# Altium schematic sheet Sheet1.SchDoc
size A4; SheetNumber: 1; SheetTotal: 1
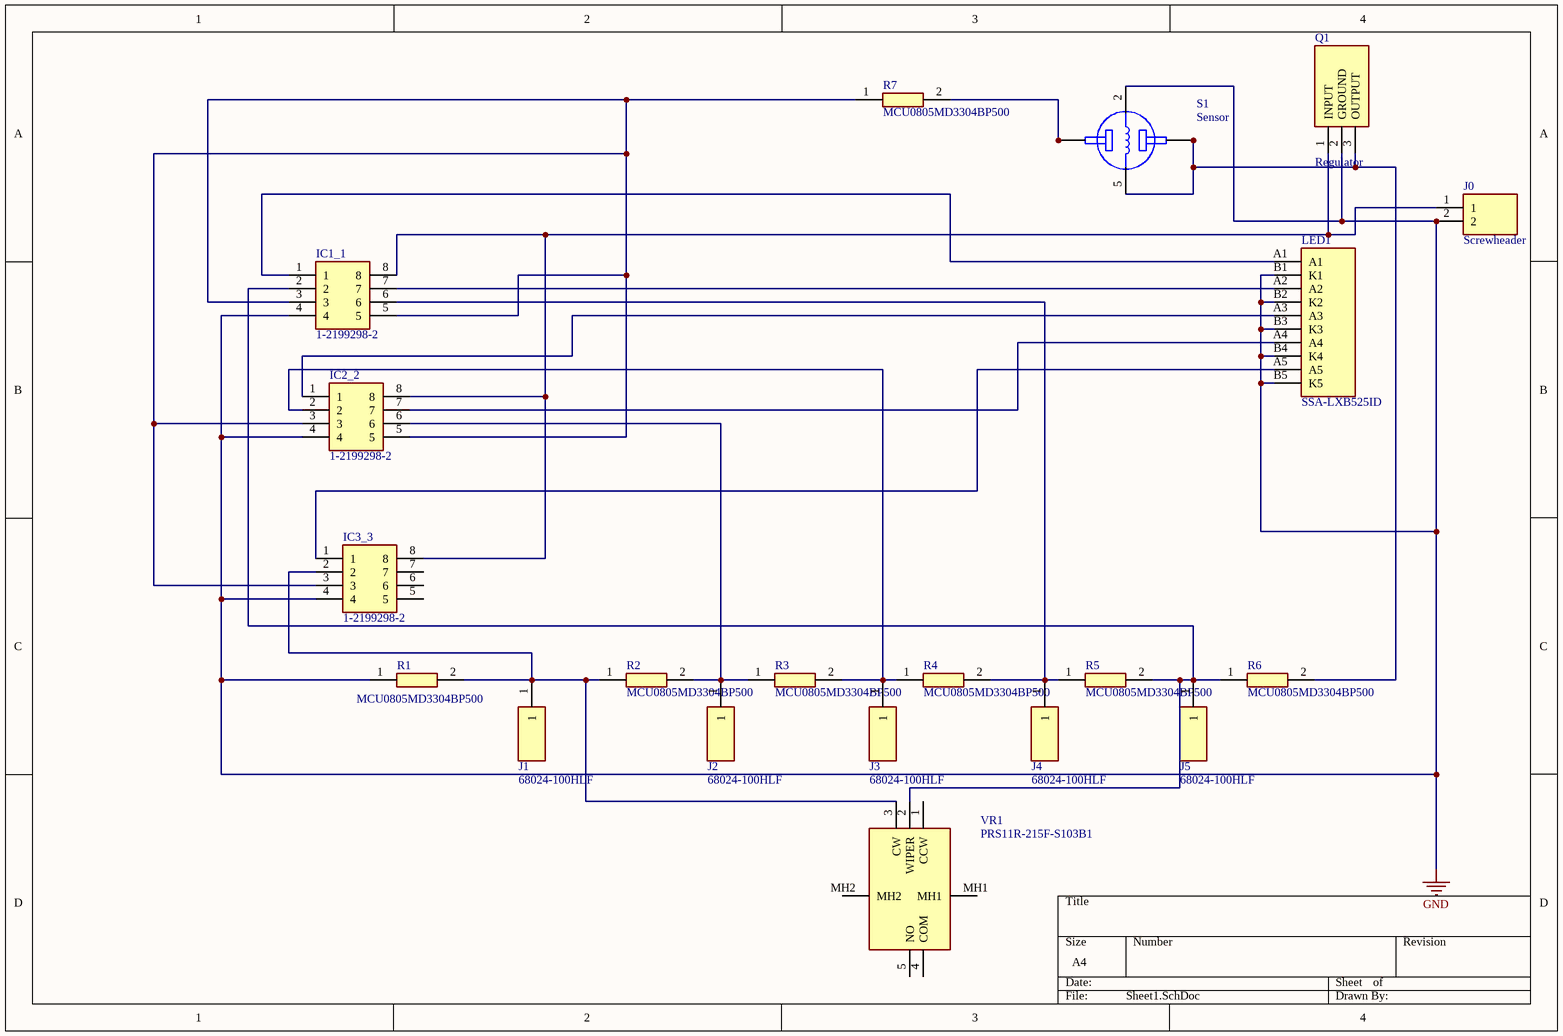
[diagram p0: Sheet1.SchDoc]

## Parts
IC1_1  1-2199298-2  [DIPS762W70P254L1016H510Q8N]
IC2_2  1-2199298-2  [DIPS762W70P254L1016H510Q8N]
IC3_3  1-2199298-2  [DIPS762W70P254L1016H510Q8N]
J0  Screwheader  [SHDR2W100P0X500_1X2_1120X800X1100P]
J1  68024-100HLF  [HDRV1W67P0X254_1X1_254X241X1082P]
J2  68024-100HLF  [HDRV1W67P0X254_1X1_254X241X1082P]
J3  68024-100HLF  [HDRV1W67P0X254_1X1_254X241X1082P]
J4  68024-100HLF  [HDRV1W67P0X254_1X1_254X241X1082P]
J5  68024-100HLF  [HDRV1W67P0X254_1X1_254X241X1082P]
LED1  SSA-LXB525ID  [SSALXB525ID]
Q1  Regulator  [TO255P460X1020X1968-3P]
R1  MCU0805MD3304BP500  [RESC2012X62N]
R2  MCU0805MD3304BP500  [RESC2012X62N]
R3  MCU0805MD3304BP500  [RESC2012X62N]
R4  MCU0805MD3304BP500  [RESC2012X62N]
R5  MCU0805MD3304BP500  [RESC2012X62N]
R6  MCU0805MD3304BP500  [RESC2012X62N]
R7  MCU0805MD3304BP500  [RESC2012X62N]
S1  Sensor  [XDCR_SEN-08880]
VR1  PRS11R-215F-S103B1  [PRS11R215FS103B1]

## Nets
GND: IC1_1.4 IC2_2.4 IC3_3.4 J0.2 LED1.B1(K1) LED1.B2(K2) LED1.B3(K3) LED1.B4(K4) LED1.B5(K5) Q1.2(GROUND) R1.1 S1.2(H1)
NetIC1_1_1: IC1_1.1 LED1.A1
NetIC1_1_2: IC1_1.2 J5.1 R5.2 R6.1 VR1.2(WIPER)
NetIC1_1_3: IC1_1.3 IC1_1.5 IC2_2.3 IC2_2.5 IC3_3.3 R7.1
NetIC1_1_6: IC1_1.6 J4.1 R4.2 R5.1
NetIC1_1_7: IC1_1.7 LED1.A2
NetIC1_1_8: IC1_1.8 IC2_2.8 IC3_3.8 J0.1 Q1.1(INPUT)
NetIC2_2_1: IC2_2.1 LED1.A3
NetIC2_2_2: IC2_2.2 J3.1 R3.2 R4.1
NetIC2_2_6: IC2_2.6 J2.1 R2.2 R3.1
NetIC2_2_7: IC2_2.7 LED1.A4
NetIC3_3_1: IC3_3.1 LED1.A5
NetIC3_3_2: IC3_3.2 J1.1 R1.2 R2.1 VR1.3(CW)
NetQ1_3: Q1.3(OUTPUT) R6.2 S1.4(B) S1.5(H2) S1.6(B)
NetR7_2: R7.2 S1.1(A) S1.3(A)

Not connected (* = marked no-connect by the designer): IC3_3 5 6 7; VR1 1(CCW) 4(COM) 5(NO) MH1 MH2

## Library data of the parts
IC1_1 IC2_2 IC3_3 = 1-2199298-2: Integrated Circuit; Manufacturer_Name: TE Connectivity; Datasheet Link: https://componentsearchengine.com/Datasheets/2/1-2199298-2.pdf; Height: 5.1mm; Manufacturer_Part_Number: 1-2199298-2; Mouser Part Number: 571-1-2199298-2; Mouser Price/Stock: https://www.mouser.co.uk/ProductDetail/TE-Connectivity/1-2199298-2?qs=fK8dlpkaUMtEKa4wabwOXQ%3D%3D; Arrow Part Number: 1-2199298-2; Arrow Price/Stock: https://www.arrow.com/en/products/1-2199298-2/te-connectivity?region=nac
J0 = 691111710002: Connector; Manufacturer_Name: Wurth Elektronik; Datasheet Link: https://componentsearchengine.com/Datasheets/1/691111710002.pdf; Height: 11mm; Manufacturer_Part_Number: 691111710002; Mouser Part Number: 710-691111710002; Mouser Price/Stock: https://www.mouser.co.uk/ProductDetail/Wurth-Elektronik/691111710002?qs=E2PpAYvlWVvK4tIr6ZnZIQ%3D%3D
J1-J5 = 68024-100HLF: Connector; Manufacturer_Name: Amphenol Communications Solutions; Datasheet Link: https://cdn.amphenol-cs.com/media/wysiwyg/files/drawing/68000.pdf; Height: 10.82mm; Manufacturer_Part_Number: 68024-100HLF; Mouser Part Number: 649-68024-100HLF; Mouser Price/Stock: https://www.mouser.co.uk/ProductDetail/Amphenol-FCI/68024-100HLF?qs=DaoqcPPPDvU%252BhB9srASBgQ%3D%3D; Arrow Part Number: 68024-100HLF; Arrow Price/Stock: https://www.arrow.com/en/products/68024-100hlf/amphenol-fci?region=nac
LED1 = SSA-LXB525ID: LED (Multiple); Manufacturer_Name: Lumex; Datasheet Link: https://datasheet.datasheetarchive.com/originals/dk/DKDS-14/273372.pdf; Height: 8.4mm; Manufacturer_Part_Number: SSA-LXB525ID; Mouser Part Number: 696-SSA-LXB525ID; Mouser Price/Stock: https://www.mouser.co.uk/ProductDetail/Lumex/SSA-LXB525ID?qs=K%252Bxkc0srH7Bjt6LUAQzTgQ%3D%3D; Arrow Part Number: SSA-LXB525ID; Arrow Price/Stock: https://www.arrow.com/en/products/ssa-lxb525id/lumex
Q1 = L7805ACV-DG: Transistor; Manufacturer_Name: STMicroelectronics; Datasheet Link: https://rs.componentsearchengine.com/Datasheets/2/L7805ACV-DG.pdf; Height: 4.6mm; Manufacturer_Part_Number: L7805ACV-DG; Mouser Part Number: 511-L7805ACV-DG; Mouser Price/Stock: https://www.mouser.co.uk/ProductDetail/STMicroelectronics/L7805ACV-DG?qs=UOUhb9503hEO7qX1qhGGyg%3D%3D; Arrow Part Number: L7805ACV-DG; Arrow Price/Stock: https://www.arrow.com/en/products/l7805acv-dg/stmicroelectronics?region=europe
R1-R7 = MCU0805MD3304BP500: Resistor; Manufacturer_Name: Vishay; Datasheet Link: https://www.mouser.in/datasheet/2/427/mc_at_precision-1762846.pdf; Height: 0.62mm; Manufacturer_Part_Number: MCU0805MD3304BP500; Mouser Part Number: 594-MCU0805MD3304BP5; Mouser Price/Stock: https://www.mouser.co.uk/ProductDetail/Vishay-Beyschlag/MCU0805MD3304BP500?qs=A6eO%252BMLsxmSZlVWVx087zg%3D%3D
VR1 = PRS11R-215F-S103B1: Variable Resistor; Manufacturer_Name: Bourns; Datasheet Link: https://www.mouser.com/catalog/specsheets/Bourns_03252021_PRS11R_datasheet.pdf; Height: 13.1mm; Manufacturer_Part_Number: PRS11R-215F-S103B1; Mouser Part Number: 652-PRS11R215FS103B1; Mouser Price/Stock: https://www.mouser.co.uk/ProductDetail/Bourns/PRS11R-215F-S103B1?qs=IS%252B4QmGtzzqZRwzYowTZrA%3D%3D